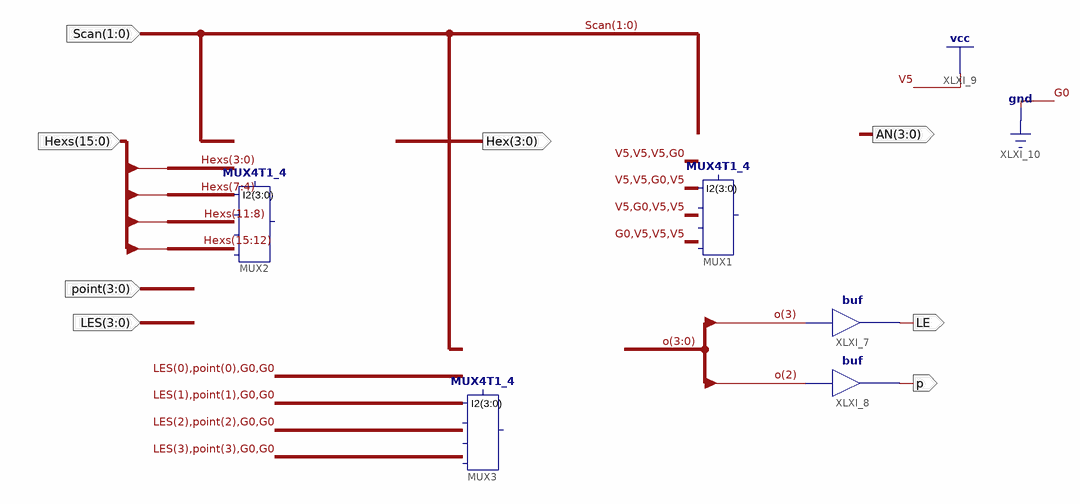
[diagram p0: schematic sheet 1]
// Xilinx ISE schematic ScanSync.sch (kintex7) as structural Verilog: 5 symbols, 8 ports
module ScanSync (
  input  [1:0] Scan,
  input  [15:0] Hexs,
  input  [3:0] point,
  input  [3:0] LES,
  output LE,
  output p,
  output [3:0] Hex,
  output [3:0] AN
);

  wire [3:0] o;

  MUX4T1_4 MUX2 (.I3(Hexs[11:8]), .I2(Hexs[7:4]), .I1(Hexs[3:0]), .I0(Hexs[15:12]), .s(Scan), .o(Hex));
  MUX4T1_4 MUX3 (
    .I3({LES[2], point[2], 2'b00}), .I2({LES[1], point[1], 2'b00}), .I1({LES[0], point[0], 2'b00}),
    .I0({LES[3], point[3], 2'b00}), .s(Scan), .o(o));
  MUX4T1_4 MUX1 (.I3(4'b1011), .I2(4'b1101), .I1(4'b1110), .I0(4'b0111), .s(Scan), .o(AN));
  buf XLXI_7 (LE, o[3]);
  buf XLXI_8 (p, o[2]);
endmodule
